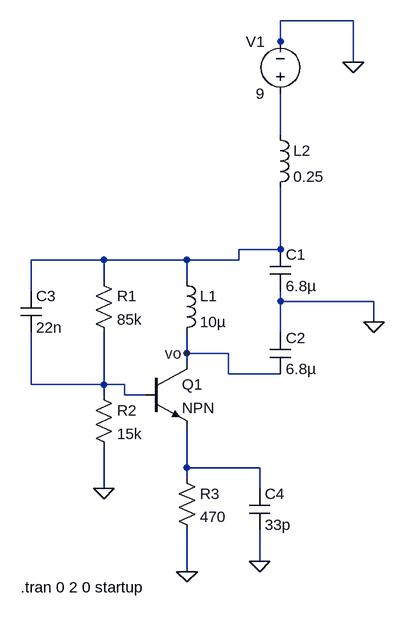
[diagram p0: schematic colpitts_oscillator.asc]
colpitts_oscillator.asc, the LTspice schematic file:
Version 4
SHEET 1 880 680
WIRE 448 -304 336 -304
WIRE 336 -272 336 -304
WIRE 336 -256 336 -272
WIRE 448 -240 448 -304
WIRE 336 -128 336 -192
WIRE 336 48 336 -48
WIRE 336 48 272 48
WIRE 64 64 -48 64
WIRE 192 64 64 64
WIRE 272 64 272 48
WIRE 272 64 192 64
WIRE 64 96 64 64
WIRE 192 96 192 64
WIRE -48 112 -48 64
WIRE 336 128 336 112
WIRE 480 128 336 128
WIRE 480 160 480 128
WIRE 336 176 336 128
WIRE 192 208 192 176
WIRE 256 208 192 208
WIRE 192 224 192 208
WIRE 256 240 256 208
WIRE 336 240 256 240
WIRE -48 256 -48 176
WIRE 64 256 64 176
WIRE 64 256 -48 256
WIRE 96 256 64 256
WIRE 64 272 64 256
WIRE 96 272 96 256
WIRE 128 272 96 272
WIRE 192 384 192 320
WIRE 304 384 192 384
WIRE 192 400 192 384
WIRE 64 416 64 352
WIRE 304 416 304 384
WIRE 304 528 304 480
WIRE 192 544 192 480
FLAG 480 160 0
FLAG 304 528 0
FLAG 192 544 0
FLAG 64 416 0
FLAG 448 -240 0
FLAG 192 208 vo
SYMBOL ind 176 80 R0
SYMATTR InstName L1
SYMATTR Value 10µ
SYMBOL cap 320 48 R0
SYMATTR InstName C1
SYMATTR Value 6.8µ
SYMBOL cap 320 176 R0
SYMATTR InstName C2
SYMATTR Value 6.8µ
SYMBOL cap -64 112 R0
SYMATTR InstName C3
SYMATTR Value 22n
SYMBOL res 48 80 R0
SYMATTR InstName R1
SYMATTR Value 85k
SYMBOL res 48 256 R0
SYMATTR InstName R2
SYMATTR Value 15k
SYMBOL res 176 384 R0
SYMATTR InstName R3
SYMATTR Value 470
SYMBOL cap 288 416 R0
SYMATTR InstName C4
SYMATTR Value 33p
SYMBOL ind 320 -144 R0
SYMATTR InstName L2
SYMATTR Value 0.25
SYMBOL voltage 336 -176 R180
WINDOW 0 24 96 Left 2
WINDOW 3 24 16 Left 2
WINDOW 123 0 0 Left 0
WINDOW 39 0 0 Left 0
SYMATTR InstName V1
SYMATTR Value 9
SYMBOL npn 128 224 R0
SYMATTR InstName Q1
TEXT -64 568 Left 2 !.tran 0 2 0 startup

The netlist it stands for:
* colpitts_oscillator.asc
L1 N002 vo 10µ
C1 N002 0 6.8µ
C2 0 vo 6.8µ
C3 N002 N003 22n
R1 N002 N003 85k
R2 N003 0 15k
R3 N004 0 470
C4 N004 0 33p
L2 N001 N002 0.25
V1 N001 0 9
Q1 vo N003 N004 0 NPN
.model NPN NPN
.model PNP PNP
.lib standard.bjt
.tran 0 2 0 startup
.backanno
.end